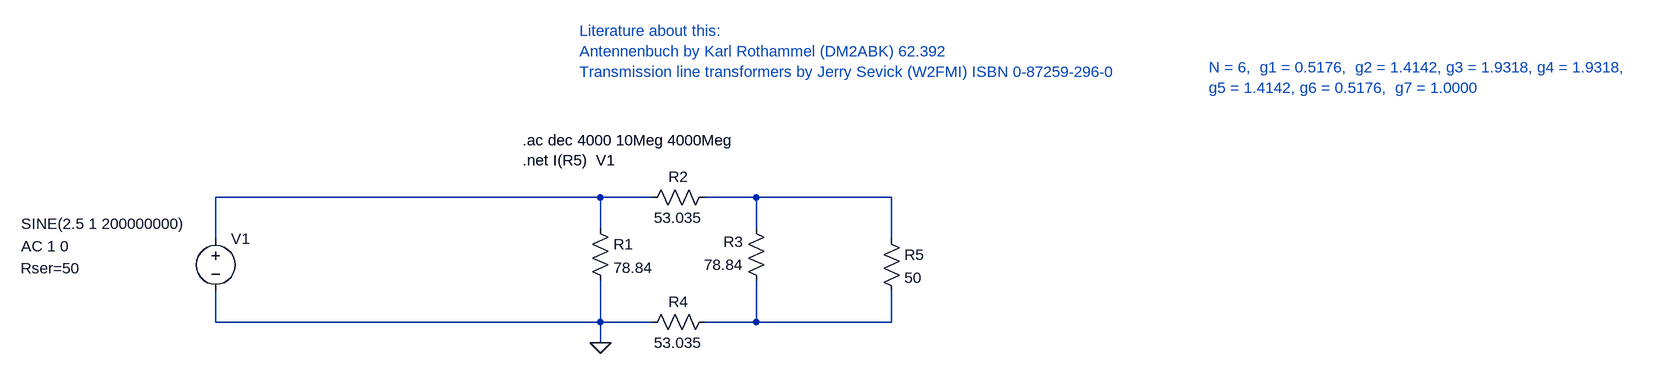
[diagram p0: schematic PI_PAD.asc]
PI_PAD.asc, the LTspice schematic file:
Version 4
SHEET 1 1860 820
WIRE -256 112 -848 112
WIRE -176 112 -256 112
WIRE -16 112 -96 112
WIRE 192 112 -16 112
WIRE -256 160 -256 112
WIRE -16 160 -16 112
WIRE -848 176 -848 112
WIRE 192 176 192 112
WIRE -848 304 -848 256
WIRE -256 304 -256 240
WIRE -256 304 -848 304
WIRE -176 304 -256 304
WIRE -16 304 -16 240
WIRE -16 304 -96 304
WIRE 192 304 192 256
WIRE 192 304 -16 304
WIRE -256 336 -256 304
FLAG -256 336 0
SYMBOL res -272 144 R0
SYMATTR InstName R1
SYMATTR Value 78.84
SYMBOL res -80 96 R90
WINDOW 0 0 56 VBottom 2
WINDOW 3 32 56 VTop 2
SYMATTR InstName R2
SYMATTR Value 53.035
SYMBOL res 0 256 R180
WINDOW 0 36 76 Left 2
WINDOW 3 36 40 Left 2
SYMATTR InstName R3
SYMATTR Value 78.84
SYMBOL voltage -848 160 R0
WINDOW 123 -299 27 Left 2
WINDOW 39 -300 61 Left 2
WINDOW 3 -299 -7 Left 2
SYMATTR Value2 AC 1 0
SYMATTR SpiceLine Rser=50
SYMATTR Value SINE(2.5 1 200000000)
SYMATTR InstName V1
SYMBOL res 176 160 R0
SYMATTR InstName R5
SYMATTR Value 50
SYMBOL res -80 288 R90
WINDOW 0 0 56 VBottom 2
WINDOW 3 32 56 VTop 2
SYMATTR InstName R4
SYMATTR Value 53.035
TEXT -376 24 Left 2 !.ac dec 4000 10Meg 4000Meg\n.net I(R5)  V1
TEXT -288 -144 Left 2 ;Literature about this:\nAntennenbuch by Karl Rothammel (DM2ABK) 62.392\nTransmission line transformers by Jerry Sevick (W2FMI) ISBN 0-87259-296-0
TEXT 680 -88 Left 2 ;N = 6,  g1 = 0.5176,  g2 = 1.4142, g3 = 1.9318, g4 = 1.9318, \ng5 = 1.4142, g6 = 0.5176,  g7 = 1.0000

The netlist it stands for:
* PI_PAD.asc
R1 N001 0 78.84
R2 N002 N001 53.035
R3 N003 N002 78.84
V1 N001 0 SINE(2.5 1 200000000) AC 1 0 Rser=50
R5 N002 N003 50
R4 N003 0 53.035
.ac dec 4000 10Meg 4000Meg
.net I(R5)  V1
* Literature about this:
* Antennenbuch by Karl Rothammel (DM2ABK) 62.392
* Transmission line transformers by Jerry Sevick (W2FMI) ISBN 0-87259-296-0
* N = 6,  g1 = 0.5176,  g2 = 1.4142, g3 = 1.9318, g4 = 1.9318,
* g5 = 1.4142, g6 = 0.5176,  g7 = 1.0000
.backanno
.end